# EAGLE design Petra_2 (EAGLE 7.6.0)
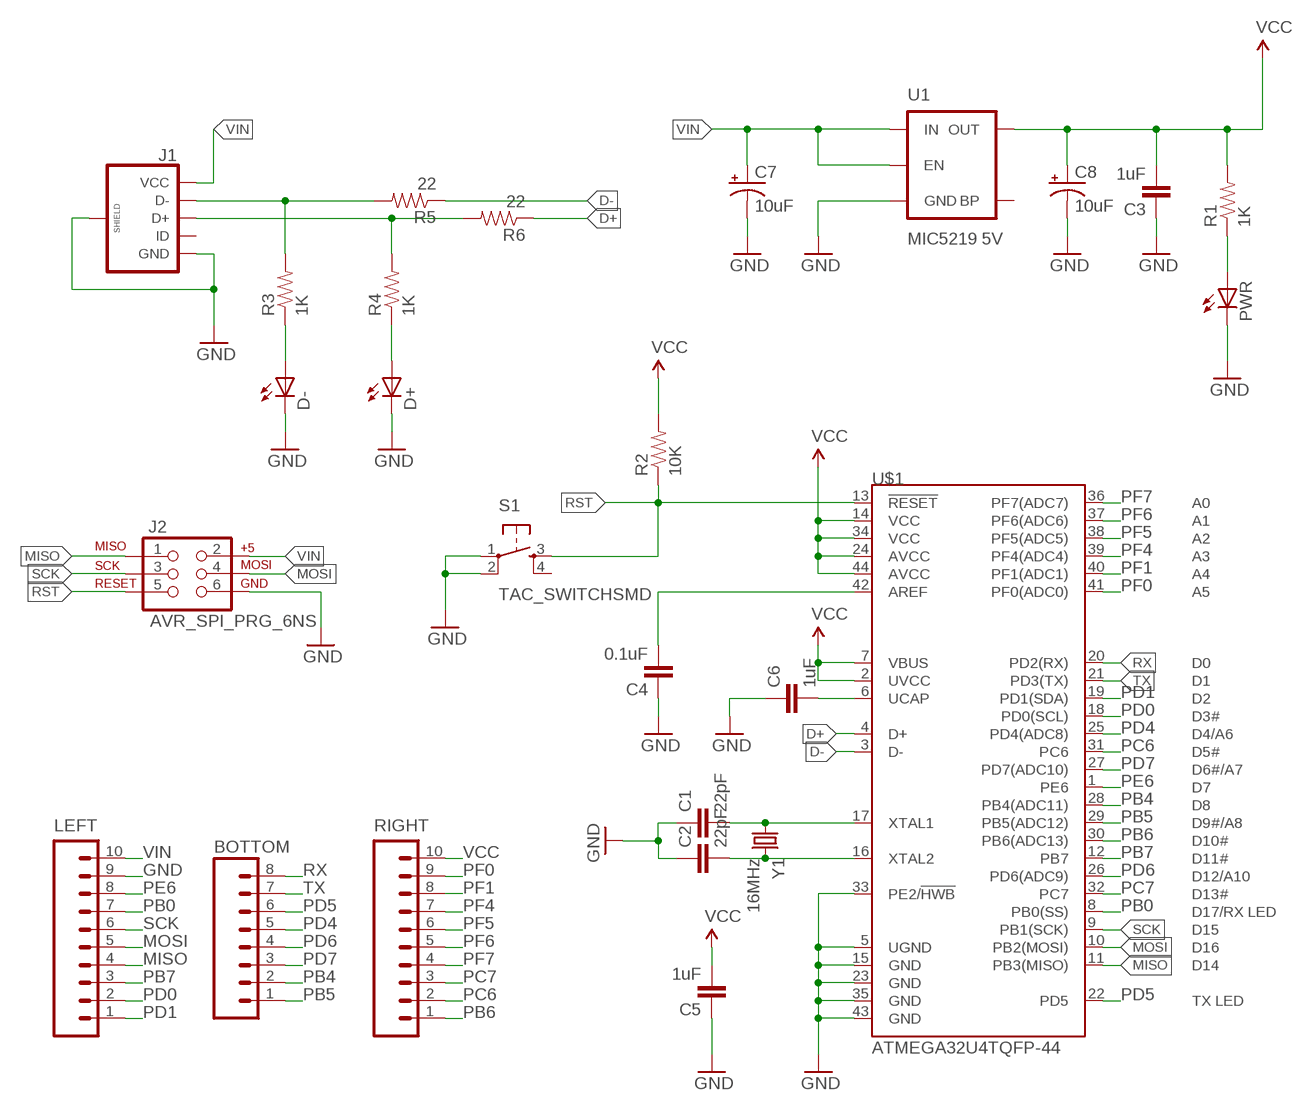
[diagram p0: schematic, sheet 1]

## Parts
BOTTOM  M08  [1X08_ROUND]
C1  22pF  CAP0402-CAP  [0402-CAP]
C2  22pF  CAP0402-CAP  [0402-CAP]
C3  1uF  CAP0402-CAP  [0402-CAP]
C4  0.1uF  CAP0402-CAP  [0402-CAP]
C5  1uF  CAP0402-CAP  [0402-CAP]
C6  1uF  CAP0402-CAP  [0402-CAP]
C7  10uF  CAP_POL1206  [EIA3216]
C8  10uF  CAP_POL1206  [EIA3216]
D+  LEDCHIP-LED0805  [CHIP-LED0805]
D-  LEDCHIP-LED0805  [CHIP-LED0805]
J1  USB_MICROB_PLUGCONN-11752  [USB-B-MICRO-SMD_V03]
J2  AVR_SPI_PRG_6NS  [2X3-NS]
LEFT  M10SILK_FEMALE_PTH  [1X10]
PWR  LEDCHIP-LED0805  [CHIP-LED0805]
R1  1K  10KOHM-1/10W-1%(0603)0603  [0603-RES]
R2  10K  10KOHM-1/10W-1%(0603)0603  [0603-RES]
R3  1K  10KOHM-1/10W-1%(0603)0603  [0603-RES]
R4  1K  10KOHM-1/10W-1%(0603)0603  [0603-RES]
R5  22  10KOHM-1/10W-1%(0603)0603  [0603-RES]
R6  22  10KOHM-1/10W-1%(0603)0603  [0603-RES]
RIGHT  M10SILK_FEMALE_PTH  [1X10]
S1  TAC_SWITCHSMD  [TACTILE-SWITCH-SMD]
U1  MIC5219 5V  V_REG_MIC52195V  [SOT23-5]
U$1  ATMEGA32U4TQFP-44  [TQFP44]
Y1  16MHz  CRYSTALCRYSTAL-SMD-5X3-16MHZ  [CRYSTAL-SMD-5X3]

## Nets
A: J1.D- R3.2 R5.2
B: J1.D+ R4.2 R6.2
D+: R6.1 U$1.4(D+)
D-: R5.1 U$1.3(D-)
GND: C1.1 C2.1 C3.1 C4.1 C5.1 C6.1 C7.C(-) C8.C(-) D+.C D-.C J1.GND J1.SHIELD1(SHIELD) J1.SHIELD2(SHIELD) J1.SHIELD3(SHIELD) J2.6 LEFT.9 PWR.C S1.1 S1.2 U1.2(GND) U$1.5(UGND) U$1.15(GND) U$1.23(GND) U$1.33(PE2/!HWB) U$1.35(GND) U$1.43(GND)
MISO: J2.1 LEFT.4 U$1.11(PB3(MISO))
MOSI: J2.4 LEFT.5 U$1.10(PB2(MOSI))
N$1: C1.2 U$1.17(XTAL1) Y1.1
N$2: C2.2 U$1.16(XTAL2) Y1.3
N$3: C6.2 U$1.6(UCAP)
N$4: C4.2 U$1.42(AREF)
N$7: PWR.A R1.1
N$9: D+.A R4.1
N$11: D-.A R3.1
PB0: LEFT.7 U$1.8(PB0(SS))
PB4: BOTTOM.2 U$1.28(PB4(ADC11))
PB5: BOTTOM.1 U$1.29(PB5(ADC12))
PB6: RIGHT.1 U$1.30(PB6(ADC13))
PB7: LEFT.3 U$1.12(PB7)
PC6: RIGHT.2 U$1.31(PC6)
PC7: RIGHT.3 U$1.32(PC7)
PD0: LEFT.2 U$1.18(PD0(SCL))
PD1: LEFT.1 U$1.19(PD1(SDA))
PD4: BOTTOM.5 U$1.25(PD4(ADC8))
PD5: BOTTOM.6 U$1.22(PD5)
PD6: BOTTOM.4 U$1.26(PD6(ADC9))
PD7: BOTTOM.3 U$1.27(PD7(ADC10))
PE6: LEFT.8 U$1.1(PE6)
PF0: RIGHT.9 U$1.41(PF0(ADC0))
PF1: RIGHT.8 U$1.40(PF1(ADC1))
PF4: RIGHT.7 U$1.39(PF4(ADC4))
PF5: RIGHT.6 U$1.38(PF5(ADC5))
PF6: RIGHT.5 U$1.37(PF6(ADC6))
PF7: RIGHT.4 U$1.36(PF7(ADC7))
RST: J2.5 R2.1 S1.3 U$1.13(!RESET)
RX: BOTTOM.8 U$1.20(PD2(RX))
SCK: J2.3 LEFT.6 U$1.9(PB1(SCK))
TX: BOTTOM.7 U$1.21(PD3(TX))
VCC: C3.2 C5.2 C8.A(+) R1.2 R2.2 RIGHT.10 U1.5(OUT) U$1.2(UVCC) U$1.7(VBUS) U$1.14(VCC) U$1.24(AVCC) U$1.34(VCC) U$1.44(AVCC)
VIN: C7.A(+) J1.VBUS(VCC) J2.2 LEFT.10 U1.1(IN) U1.3(EN)
Unconnected: J1.ID S1.4 U1.4(BP)

## Library data of the parts
BOTTOM = SparkFun-Connectors:M08: Header 8 Standard 8-pin 0.1" header. Use with straight break away headers (SKU : PRT-00116), right angle break away headers (PRT-00553), swiss pins (PRT-00743), machine pins (PRT-00117), and female headers (PRT-00115).; PROD_ID: CONN-08437
C1-C6 = SparkFun-Passives:CAP: Capacitor Standard 0603 ceramic capacitor, and 0.1" leaded capacitor.
C7 C8 = SparkFun-Passives:CAP_POL: Capacitor Polarized These are standard SMD and PTH capacitors. Normally 10uF, 47uF, and 100uF in electrolytic and tantalum varieties. Always verify the external diameter of the through hole cap, it varies with capacity, voltage, and manufacturer. The EIA devices should be standard.
D+ D- PWR = led:LED: LED OSRAM: - CHIPLED LG R971, LG N971, LY N971, LG Q971, LY Q971, LO R971, LY R971 LH N974, LH R974 LS Q976, LO Q976, LY Q976 LO Q996 - Hyper CHIPLED LW Q18S LB Q993, LB Q99A, LB R99A - SideLED LS A670, LO A670, LY A670, LG A670, LP A670 LB A673, LV A673, LT A673, LW A673 LH A674 LY A675 LS A676, LA A676, LO A676, LY A676, LW A676 LS A679, LY A679, LG A679 - Hyper Micro SIDELED® LS Y876, LA Y876, LO Y876, LY Y876 LT Y87S - SmartLED LW L88C, LW L88S LB L89C, LB L89S, LG L890 LS L89K, LO L89K, LY L89K LS L896, LA L896, LO L896, LY L896 - TOPLED LS T670, LO T670, LY T670, LG T670, LP T670 LSG T670, LSP T670, LSY T670, LOP T670, LYG T670 LG T671, LOG T671, LSG T671 LB T673, LV T673, LT T673, LW T673 LH T674 LS T676, LA T676, LO T676, LY T676, LB T676, LH T676, LSB T676, LW T676 LB T67C, LV T67C, LT T67C, LS T67K, LO T67K, LY T67K, LW E67C LS E67B, LA E67B, LO E67B, LY E67B, LB E67C, LV E67C, LT E67C LW T67C LS T679, LY T679, LG T679 LS T770, LO T770, LY T770, LG T770, LP T770 LB T773, LV T773, LT T773, LW T773 LH T774 LS E675, LA E675, LY E675, LS T675 LS T776, LA T776, LO T776, LY T776, LB T776 LHGB T686 LT T68C, LB T68C - Hyper Mini TOPLED® LB M676 - Mini TOPLED Santana® LG M470 LS M47K, LO M47K, LY M47K Source: http://www.osram.convergy.de LUXEON: - LUMILED® LXK2-PW12-R00, LXK2-PW12-S00, LXK2-PW14-U00, LXK2-PW14-V00 LXK2-PM12-R00, LXK2-PM12-S00, LXK2-PM14-U00 LXK2-PE12-Q00, LXK2-PE12-R00, LXK2-PE12-S00, LXK2-PE14-T00, LXK2-PE14-U00 LXK2-PB12-K00, LXK2-PB12-L00, LXK2-PB12-M00, LXK2-PB14-N00, LXK2-PB14-P00, LXK2-PB14-Q00 LXK2-PR12-L00, LXK2-PR12-M00, LXK2-PR14-Q00, LXK2-PR14-R00 LXK2-PD12-Q00, LXK2-PD12-R00, LXK2-PD12-S00 LXK2-PH12-R00, LXK2-PH12-S00 LXK2-PL12-P00, LXK2-PL12-Q00, LXK2-PL12-R00 Source: www.luxeon.com KINGBRIGHT: KA-3528ASYC Source: www.kingbright.com
J1 = SparkFun-Connectors:USB_MICROB_PLUG: USB Micro-B connectors Some male, some female. Watch your step!; PROD_ID: CONN-11752
J2 = SparkFun-Connectors:AVR_SPI_PRG_6: AVR ISP 6 Pin This is the reduced ISP connector for AVR programming. Common on Arduino. This footprint will take up less PCB space and can be used with a 10-pin to 6-pin adapter such as SKU: BOB-08508 **Special note about "TEST_POINT" package. The stop mask is on the top side, so if you want your programming test points to be on the bottom of your board, make sure to place this package on the bottom side of the board. This also ensure that the orientation to program from the bottom side will be correct.
LEFT RIGHT = SparkFun-Connectors:M10: Header 10 Standard 10-pin 0.1" header. Use with straight break away headers (SKU : PRT-00116), right angle break away headers (PRT-00553), swiss pins (PRT-00743), machine pins (PRT-00117), and female headers (PRT-00115).; PROD_ID: CONN-11563
R1 R3-R6 = SparkFun-Resistors:10KOHM-1/10W-1%(0603): RES-00824; PROD_ID: RES-00824; VALUE: 10K
R2 = SparkFun-Resistors:10KOHM-1/10W-1%(0603): RES-00824; PROD_ID: RES-00824
S1 = SparkFun-Retired:TAC_SWITCH: Momentary Switch Button commonly used for reset or general input. Spark Fun Electronics SKU : COM-00097 SMT- SWCH-08247; PROD_ID: SWCH-08247
U1 = SparkFun-PowerIC:V_REG_MIC5219: V_REG MIC5219 Standard 3.3V and 5V 500mA LDO voltage regulator in SOT-23 layout. Micrel part MIC5219. BP (by-pass) pin is used to lower output noise with 470pF cap, may be left open.; PROD_ID: VREG-10107
U$1 = SparkFun-DigitalIC:ATMEGA32U4: Atmel 44-pin 8-bit Microcontroller with 32KBytes of ISP Flash and USB Controller
Y1 = SparkFun-FreqCtrl:CRYSTAL: Various standard crystals. Proven footprints.; PROD_ID: XTAL-08218

## Net classes
0 default: width 0.254 mm, drill 0.356 mm, clearance 0.203 mm

## Board
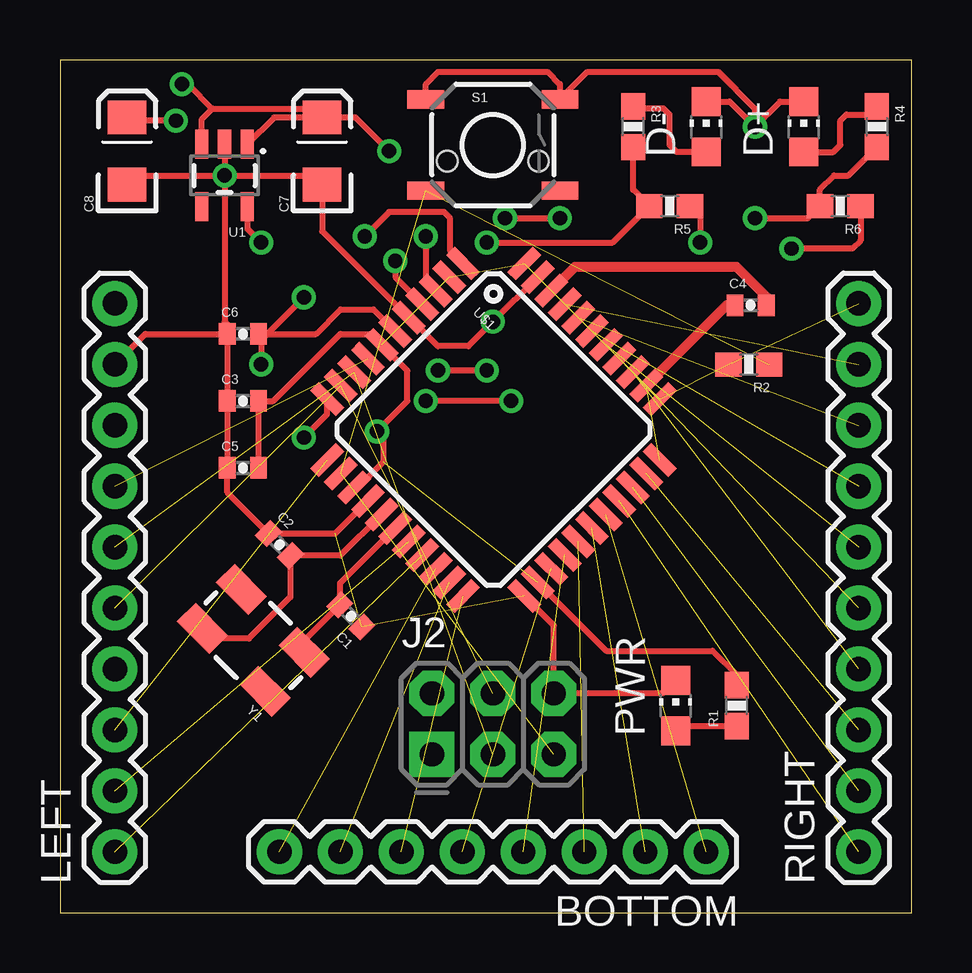
[diagram p1: board, top side]
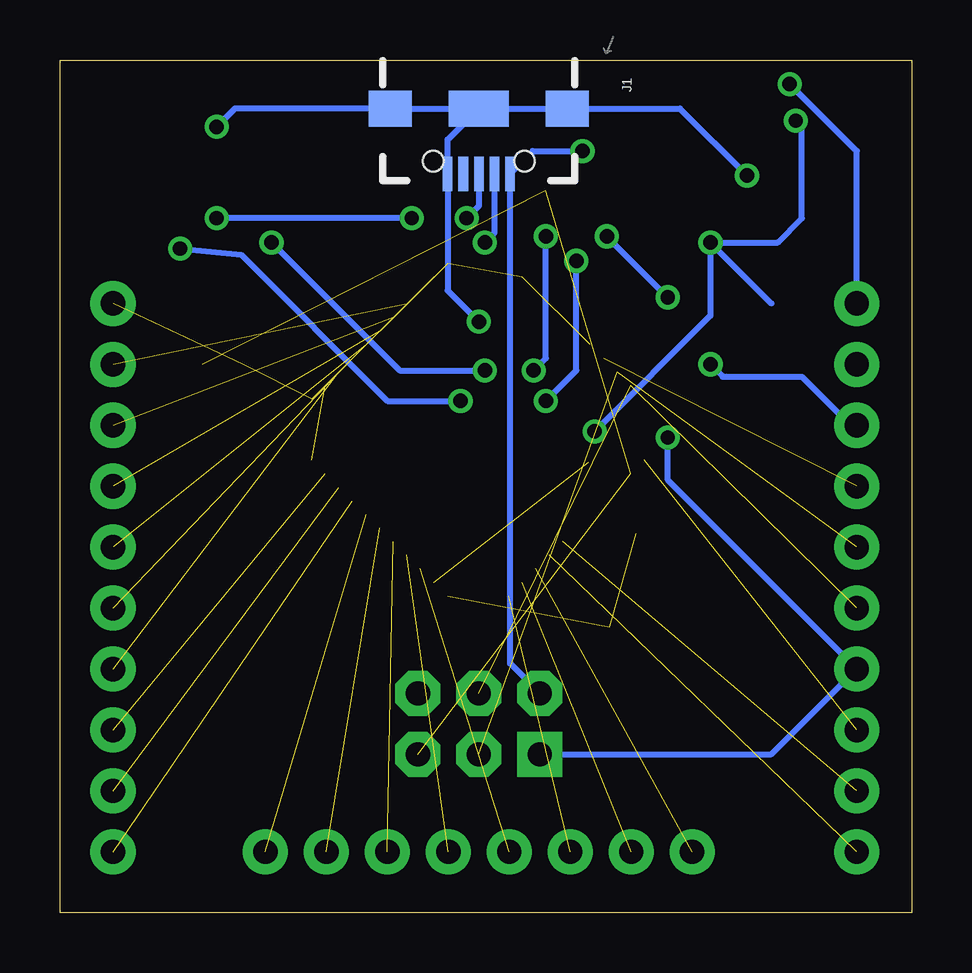
[diagram p2: board, bottom side, seen from below]

Size 35.48 x 35.55 mm. Coordinates in mm from the lower left corner, seen from the top.
Outline: 0,0 35.48,0 35.48,35.55 0,35.55 0,0
Copper layers (1*16): Top 0.035mm / dielectric 1.5mm / Bottom 0.035mm
Design rules "default": minimum track width 10mil, minimum drill 24mil, track to track 8mil, track to pad 8mil, pad to pad 8mil, via to via 8mil, smd to smd 8mil, copper to edge 40mil, drill to drill 8mil, minimum pad ring 10mil, minimum via ring 8mil, stop-mask expansion 4mil, vias tented up to drill 0mil, thermal gap 10mil

### Footprints (pad centres in the part's own frame; a part is rotated, then mirrored left to right if it is on the bottom)
1X08_ROUND = drill 1.016 pad 1.88: 1 0,0; 2 2.54,0; 3 5.08,0; 4 7.62,0; 5 10.16,0; 6 12.7,0; 7 15.24,0; 8 17.78,0
0402-CAP = smd 0.7 x 0.9: 1 -0.65,0; 2 0.65,0
EIA3216 = smd 1.4 x 1.6: A 1.4,0; C -1.4,0
CHIP-LED0805 = smd 1.2 x 1.2: A 0,-1.05; C 0,1.05
USB-B-MICRO-SMD_V03 = smd 1.45 x 0.4: D+ 2.725,0; D- 2.725,0.65; GND 2.725,-1.3; ID 2.725,-0.65; VBUS 2.725,1.3 | smd 1.5 x 1.8: SHIELD1 0,3.685; SHIELD2 0,-3.685 | smd 1.5 x 2.5: SHIELD3 0,0 | hole 0.85: 2.2,1.9; 2.2,-1.9
2X3-NS = drill 1.016 pad 1.88 square: 1 -2.54,-1.27 | drill 1.016 pad 1.88 octagon: 2 -2.54,1.27; 3 0,-1.27; 4 0,1.27; 5 2.54,-1.27; 6 2.54,1.27
1X10 = drill 1.016 pad 1.88: 1 0,0; 2 2.54,0; 3 5.08,0; 4 7.62,0; 5 10.16,0; 6 12.7,0; 7 15.24,0; 8 17.78,0; 9 20.32,0; 10 22.86,0
0603-RES = smd 1.1 x 1: 1 -0.85,0; 2 0.85,0
TACTILE-SWITCH-SMD = smd 1.524 x 0.762: 1 -2.794,1.905; 2 2.794,1.905; 3 -2.794,-1.905; 4 2.794,-1.905
SOT23-5 = smd 0.55 x 1.2: 1 -0.95,-1.3; 2 0,-1.3; 3 0.95,-1.3; 4 0.95,1.3; 5 -0.95,1.3
TQFP44 = smd 1.5 x 0.5: 1 -5.8,4; 2 -5.8,3.2; 3 -5.8,2.4; 4 -5.8,1.6; 5 -5.8,0.8; 6 -5.8,0; 7 -5.8,-0.8; 8 -5.8,-1.6; 9 -5.8,-2.4; 10 -5.8,-3.2; 11 -5.8,-4; 23 5.8,-4; 24 5.8,-3.2; 25 5.8,-2.4; 26 5.8,-1.6; 27 5.8,-0.8; 28 5.8,0; 29 5.8,0.8; 30 5.8,1.6; 31 5.8,2.4; 32 5.8,3.2; 33 5.8,4 | smd 0.5 x 1.5: 12 -4,-5.8; 13 -3.2,-5.8; 14 -2.4,-5.8; 15 -1.6,-5.8; 16 -0.8,-5.8; 17 0,-5.8; 18 0.8,-5.8; 19 1.6,-5.8; 20 2.4,-5.8; 21 3.2,-5.8; 22 4,-5.8; 34 4,5.8; 35 3.2,5.8; 36 2.4,5.8; 37 1.6,5.8; 38 0.8,5.8; 39 0,5.8; 40 -0.8,5.8; 41 -1.6,5.8; 42 -2.4,5.8; 43 -3.2,5.8; 44 -4,5.8
CRYSTAL-SMD-5X3 = smd 1.9 x 1.1: 1 -1.85,-1.15; 2 1.85,-1.15; 3 1.85,1.15; 4 -1.85,1.15

### Placement (x,y rotation side)
BOTTOM  26.92,2.54 180 top
C1  12.12,12.37 135 top
C2  9.14,15.35 315 top
C3  7.62,21.34 0 top
C4  28.78,25.33 0 top
C5  7.62,18.54 0 top
C6  7.62,24.13 0 top
C7  10.92,31.75 90 top
C8  2.79,31.75 90 top
D+  30.99,32.77 0 top
D-  26.92,32.77 0 top
J1  18.03,33.53 270 bottom
J2  18.03,7.87 0 top
LEFT  2.29,2.54 90 top
PWR  25.65,8.64 0 top
R1  28.19,8.64 90 top
R2  28.7,22.86 180 top
R3  23.88,32.77 270 top
R4  34.04,32.77 270 top
R5  25.4,29.46 180 top
R6  32.51,29.46 180 top
RIGHT  33.27,2.54 90 top
S1  18.03,32 0 top
U1  6.86,30.73 180 top
U$1  18.06,20.14 315 top
Y1  8.05,11.36 135 top

### Tracks (layer width: path | path; a pad name or v marks a point on that pad's centre or on a via)
A  (via drill 0.6)
  Top 0.254: v17.78,27.94 23.03,27.94 R5.2 23.88,30.14 R3.2
  Bottom 0.254: J1.D- 17.38,28.34 v17.78,27.94
B  (via drill 0.6)
  Top 0.254: v18.54,28.96 v20.83,28.96 | v28.96,28.96 31.15,28.96 R6.2 31.66,30.14 32.26,30.73 32.85,30.73 R4.2
  Bottom 0.254: J1.D+ 18.03,29.46 v18.54,28.96 | v20.83,28.96 v28.96,28.96
D+  (via drill 0.6)
  Top 0.254: R6.1 33.36,28.03 33.02,27.69 v30.48,27.69 | v18.8,21.34 v15.24,21.34 | v13.97,27.18 13.97,26.5 U$1.4
  Bottom 0.254: v30.48,27.69 27.94,27.43 21.84,21.34 v18.8,21.34 | v15.24,21.34 13.97,22.61 v13.97,27.18
D-  (via drill 0.6)
  Top 0.254: R5.1 26.67,29.04 v26.67,27.94 | v17.78,22.61 v15.75,22.61 | v15.24,28.19 15.24,26.36 U$1.3
  Bottom 0.254: v26.67,27.94 21.34,22.61 v17.78,22.61 | v15.75,22.61 15.24,23.11 v15.24,28.19
GND  (via drill 0.6)  (4 unrouted)
  Top 0.254: U$1.15 11.47,15.8 C2.1 6.97,17.52 C5.1 C3.1 C6.1 | PWR.C 25.11,9.14 J2.6 20.57,11.97 U$1.23 | S1.1 15.24,34.54 15.75,35.05 20.32,35.05 20.83,34.54 S1.2 21.97,35.05 27.43,35.05 28.96,33.53 v28.96,32.77 | 10.92,30.48 C7.C 10.92,30.23 | U$1.43 v18.04,24.64 v18.03,24.64 17.02,23.62 15.75,23.62 14.56,24.81 U$1.5 10.92,28.41 10.92,30.23 | U1.2 v6.86,30.73 | C8.C 3.18,30.73 v6.86,30.73 | v6.86,30.73 10.41,30.73 10.92,30.23 | v6.86,30.73 6.86,24.64 6.97,24.53 C6.1 | v28.96,32.77 30.01,33.82 D+.C | D-.C 27.91,33.82 v28.96,32.77 | LEFT.9 3.56,24.13 C6.1
  Top 0.406: C4.1 27.78,25.33 U$1.35
  Bottom 0.254: J1.GND 19.33,32.23 J1.SHIELD3 | J1.GND 19.33,31.14 | J1.SHIELD3 J1.SHIELD1 9.65,33.53 v6.86,30.73 | J1.SHIELD3 J1.SHIELD2 28.19,33.53 v28.96,32.77 | J1.GND 19.33,25.94 v18.03,24.64
MISO  (via drill 0.6)
  Top 0.254: v10.16,19.81 11.13,20.79 U$1.11
  Bottom 0.254: J2.1 5.84,6.6 LEFT.4 10.16,18.03 v10.16,19.81
MOSI  (2 unrouted)
N$1
  Top 0.254: U$1.17 11.66,13.73 C1.2 10.18,11.35 Y1.1
N$2
  Top 0.254: U$1.16 11.68,14.89 C2.2 9.6,13.16 7.87,11.43 6.35,11.43 Y1.3
N$3
  Top 0.254: C6.2 10.67,24.13 11.68,25.15 13.06,25.15 U$1.6
N$4
  Top 0.406: C4.2 29.43,25.69 28.19,26.92 21.45,26.92 U$1.42
N$7
  Top 0.254: PWR.A 25.85,7.79 R1.1
N$9
  Top 0.254: D+.A 32.22,31.72 32.51,32 32.51,33.02 32.77,33.27 33.69,33.27 R4.1
N$11
  Top 0.254: D-.A 25.69,31.72 25.4,32 25.4,33.27 25.15,33.53 23.96,33.53 R3.1
PB0  (1 unrouted)
PB4  (1 unrouted)
PB5  (1 unrouted)
PB6  (1 unrouted)
PB7  (1 unrouted)
PC6  (1 unrouted)
PC7  (1 unrouted)
PD0  (1 unrouted)
PD1  (1 unrouted)
PD4  (1 unrouted)
PD5  (1 unrouted)
PD6  (1 unrouted)
PD7  (1 unrouted)
PE6  (via drill 0.6)
  Top 0.254: U$1.1 16.26,27.61 16.26,28.96 16,29.21 13.72,29.21 v12.7,28.19 | v10.16,25.65 8.38,23.88 v8.38,22.86
  Bottom 0.254: v12.7,28.19 v10.16,25.65 | v8.38,22.86 7.87,22.35 4.57,22.35 2.54,20.32 LEFT.8
PF0  (1 unrouted)
PF1  (1 unrouted)
PF4  (1 unrouted)
PF5  (1 unrouted)
PF6  (1 unrouted)
PF7  (1 unrouted)
RST  (3 unrouted)
RX  (1 unrouted)
SCK  (2 unrouted)
TX  (1 unrouted)
VCC  (via drill 0.6)  (6 unrouted)
  Top 0.254: U$1.24 22.76,10.92 27.18,10.92 28.19,9.91 R1.2 | U1.5 7.81,28.51 v8.38,27.94 | v4.83,33.02 2.92,33.02 C8.A | U$1.14 12.4,17.74 13.46,18.8 13.46,19.81 v13.21,20.07 14.48,21.34 14.48,22.6 U$1.7 12.94,24.13 11.68,24.13 8.89,21.34 C3.2 C5.2
  Bottom 0.254: v8.38,27.94 5.59,27.94 4.57,28.96 4.57,32.77 v4.83,33.02 | v8.38,27.94 8.38,24.89 v13.21,20.07 | 5.84,25.4 v8.38,27.94
VIN  (via drill 0.6)
  Top 0.254: v13.72,31.75 12.32,33.15 C7.A | C7.A 8.92,33.15 U1.1 | U1.3 5.91,33.09 6.35,33.53 | 6.35,33.53 10.54,33.53 C7.A | v5.08,34.54 5.33,34.54 6.35,33.53
  Bottom 0.254: v13.72,31.75 15.79,31.75 J1.VBUS 16.73,10.38 J2.2 | LEFT.10 2.29,31.75 v5.08,34.54